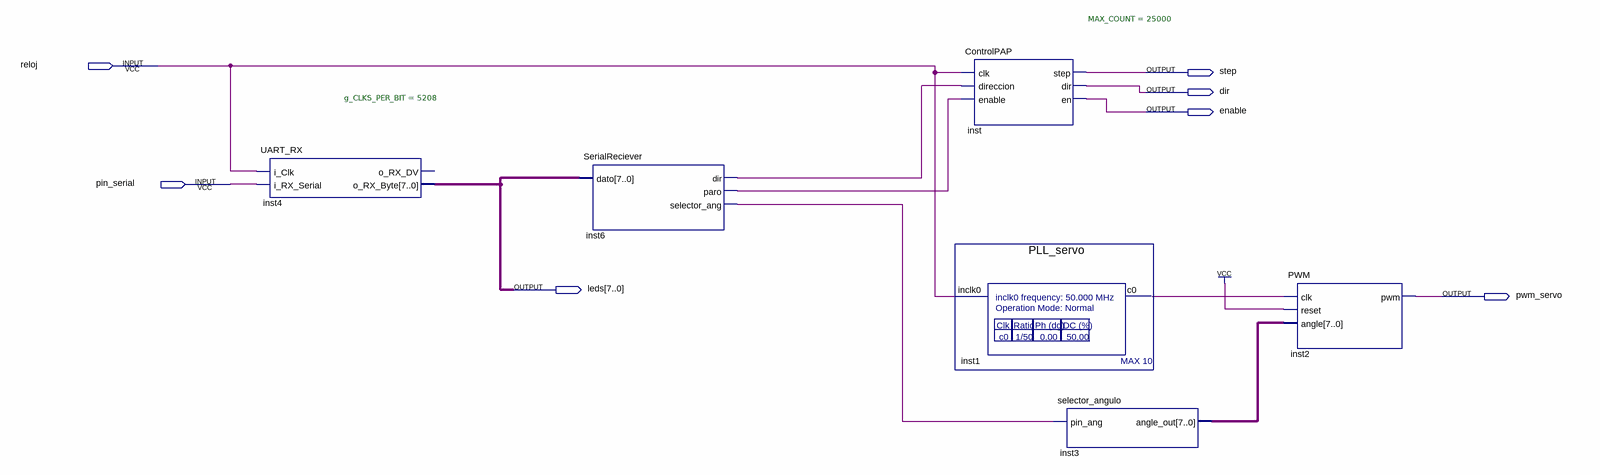
[diagram p0: schematic sheet]
// Quartus schematic GeneralControlScheme.bdf as structural Verilog: 6 symbols, 7 pins
module GeneralControlScheme (
  input  reloj,
  input  pin_serial,
  output step,
  output dir,
  output enable,
  output [7:0] leds,
  output pwm_servo
);

  wire inst1_c0, inst6_dir, inst6_paro, inst6_selector_ang;
  wire [7:0] inst3_angle_out;

  UART_RX #(.g_CLKS_PER_BIT(5208)) inst4 (.i_Clk(reloj), .i_RX_Serial(pin_serial), .o_RX_Byte(leds));  // open: o_RX_DV
  SerialReciever inst6 (.dato(leds), .dir(inst6_dir), .paro(inst6_paro), .selector_ang(inst6_selector_ang));
  ControlPAP #(.MAX_COUNT(25000)) inst (
    .clk(reloj), .direccion(inst6_dir), .enable(inst6_paro), .step(step), .dir(dir), .en(enable));
  PLL_servo inst1 (.inclk0(reloj), .c0(inst1_c0));
  selector_angulo inst3 (.pin_ang(inst6_selector_ang), .angle_out(inst3_angle_out));
  PWM inst2 (.clk(inst1_c0), .reset(1'b1), .angle(inst3_angle_out), .pwm(pwm_servo));
endmodule
